# Altium project PCB_SECOND.PrjPcb
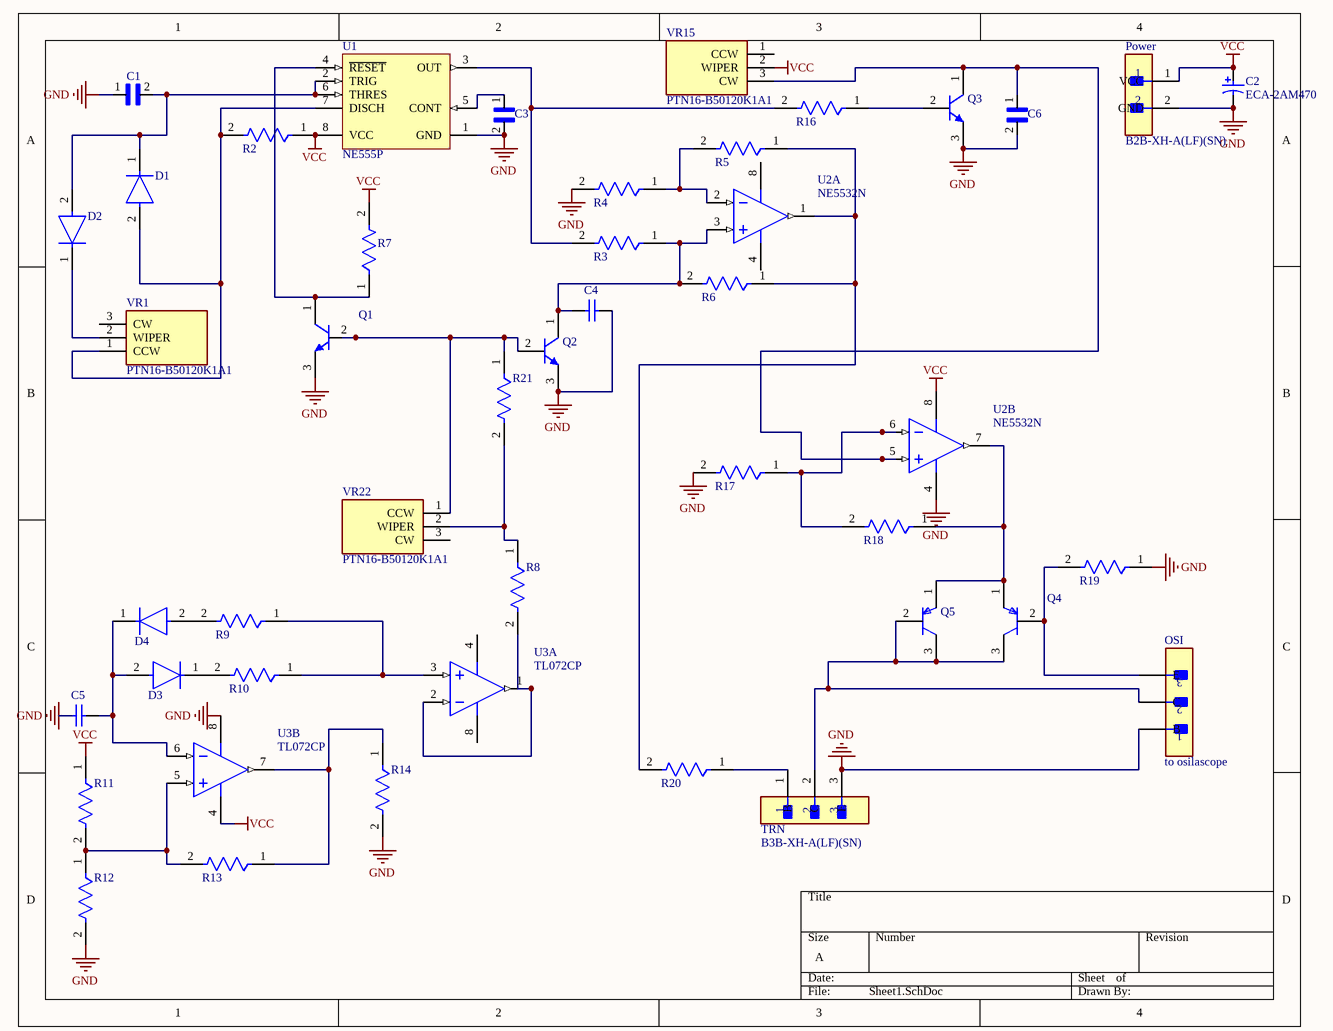
[diagram p0: Sheet1.SchDoc]
1 sheet, 43 parts. Net scope: global (net labels, ports and power ports of the same name join across sheets).
Board file: PCB1.PcbDoc

## Sheet Sheet1.SchDoc
size A; SheetNumber: 1; SheetTotal: 1

### Parts
C1  FG24X7R1A106KRT00  [CAPRB500W50L450T300H550]  (value not drawn)
C2  ECA-2AM470  [CAPPR65-350-1150X800X1250]
C3  FG24X7R1A106KRT00  [CAPRB500W50L450T300H550]  (value not drawn)
C4  SA115C104KAR  [AVX-SA115C104KAR]  (value not drawn)
C5  SA115C104KAR  [AVX-SA115C104KAR]  (value not drawn)
C6  FG24X7R1A106KRT00  [CAPRB500W50L450T300H550]  (value not drawn)
D1  1N4001-E3/54  [FP-1N4001-E3-54-MFG]  (value not drawn)
D2  1N4001-E3/54  [FP-1N4001-E3-54-MFG]  (value not drawn)
D3  1N4001-E3/54  [FP-1N4001-E3-54-MFG]  (value not drawn)
D4  1N4001-E3/54  [FP-1N4001-E3-54-MFG]  (value not drawn)
OSI  to osilascope  [FP-B3B-XH-A_LF_SN-MFG]
Power  B2B-XH-A(LF)(SN)  [FP-B2B-XH-A_LF_SN-MFG]
Q1  P2N2222ARL1G  [ONSC-TO-92-3-29-11_AM_BL]  (value not drawn)
Q2  P2N2222ARL1G  [ONSC-TO-92-3-29-11_AM_BL]  (value not drawn)
Q3  P2N2222ARL1G  [ONSC-TO-92-3-29-11_AM_BL]  (value not drawn)
Q4  2N3906TF  [FP-135AR-MFG]  (value not drawn)
Q5  2N3906TF  [FP-135AR-MFG]  (value not drawn)
R2  MRS16000C2002FCT00  [FP-MRS1600-MFG]  (value not drawn)
R3  MRS16000C2002FCT00  [FP-MRS1600-MFG]  (value not drawn)
R4  MRS16000C2002FCT00  [FP-MRS1600-MFG]  (value not drawn)
R5  MRS16000C2002FCT00  [FP-MRS1600-MFG]  (value not drawn)
R6  MRS16000C2002FCT00  [FP-MRS1600-MFG]  (value not drawn)
R7  MRS16000C2002FCT00  [FP-MRS1600-MFG]  (value not drawn)
R8  MRS16000C2002FCT00  [FP-MRS1600-MFG]  (value not drawn)
R9  MRS16000C2002FCT00  [FP-MRS1600-MFG]  (value not drawn)
R10  MRS16000C2002FCT00  [FP-MRS1600-MFG]  (value not drawn)
R11  MRS16000C2002FCT00  [FP-MRS1600-MFG]  (value not drawn)
R12  MRS16000C2002FCT00  [FP-MRS1600-MFG]  (value not drawn)
R13  MRS16000C2002FCT00  [FP-MRS1600-MFG]  (value not drawn)
R14  MRS16000C2002FCT00  [FP-MRS1600-MFG]  (value not drawn)
R16  MRS16000C2002FCT00  [FP-MRS1600-MFG]  (value not drawn)
R17  MRS16000C2002FCT00  [FP-MRS1600-MFG]  (value not drawn)
R18  MRS16000C2002FCT00  [FP-MRS1600-MFG]  (value not drawn)
R19  MRS16000C2002FCT00  [FP-MRS1600-MFG]  (value not drawn)
R20  MRS16000C2002FCT00  [FP-MRS1600-MFG]  (value not drawn)
R21  MRS16000C2002FCT00  [FP-MRS1600-MFG]  (value not drawn)
TRN  B3B-XH-A(LF)(SN)  [FP-B3B-XH-A_LF_SN-MFG]
U1  NE555P  [P0008A]
U2  NE5532N  [ONSC-PDIP-8-626-05]  (parts A,B of 2)
U3  TL072CP  [P0008A]  (parts A,B of 2)
VR1  PTN16-B50120K1A1  [PTN16B50120K1A1]
VR15  PTN16-B50120K1A1  [PTN16B50120K1A1]
VR22  PTN16-B50120K1A1  [PTN16B50120K1A1]

### Nets
GND: C1.1 C2.2 C3.2 C4.2 C5.1 C6.2 OSI.1(B) Power.2(GND) Q1.3(E) Q2.3(E) Q3.3(E) R4.2 R12.2 R14.2 R17.2 R19.1 TRN.3(E) U1.1(GND) U2.4(V-) U3.8(VCC+)
VCC: C2.1 Power.1(VCC) R2.1 R7.2 R11.1 U1.8(VCC) U2.8(V+) U3.4(VCC-) VR15.2(WIPER)
NetC1_2: C1.2 D1.1(C) D2.2(A) U1.2(TRIG) U1.6(THRES)
NetC3_1: C3.1 U1.5(CONT)
NetC4_1: C4.1 Q2.1(C) R3.1 R6.2 U2.3(INA+)
NetC5_2: C5.2 D3.2(A) D4.1(C) U3.6(IN2-)
NetC6_1: C6.1 Q3.1(C) U2.5(INB+) VR15.3(CW)
NetD1_2: D1.2(A) R2.2 U1.7(DISCH) VR1.1(CCW)
NetD2_1: D2.1(C) VR1.2(WIPER)
NetD3_1: D3.1(C) R10.2
NetD4_2: D4.2(A) R9.2
NetOSI_2: OSI.2(C) Q4.3(C) Q5.2(B) Q5.3(C) TRN.2(C)
NetOSI_3: OSI.3(E) Q4.2(B) R19.2
NetQ1_1: Q1.1(C) R7.1 U1.4(~{RESET})
NetQ1_2: Q1.2(B) Q2.2(B) R21.1 VR22.1(CCW)
NetQ3_2: Q3.2(B) R16.1
NetQ4_1: Q4.1(E) Q5.1(E) R18.1 U2.7(OUTB)
NetR3_2: R3.2 R16.2 U1.3(OUT)
NetR4_1: R4.1 R5.2 U2.2(INA-)
NetR5_1: R5.1 R6.1 R20.2 U2.1(OUTA)
NetR8_1: R8.1 R21.2 VR22.2(WIPER)
NetR8_2: R8.2 U3.1(OUT1) U3.2(IN1-)
NetR9_1: R9.1 R10.1 U3.3(IN1+)
NetR11_2: R11.2 R12.1 R13.2 U3.5(IN2+)
NetR13_1: R13.1 R14.1 U3.7(OUT2)
NetR17_1: R17.1 R18.2 U2.6(INB-)
NetR20_1: R20.1 TRN.1(B)

Not connected (* = marked no-connect by the designer): VR1 3(CW); VR15 1(CCW); VR22 3(CW)

### Library data of the parts
C1 C3 C6 = FG24X7R1A106KRT00: 10 ÂµF Â±10% 10V Ceramic Capacitor X7R Radial; MF: TDK; Purchase-URL: https://pricing.snapeda.com/search/part/FG24X7R1A106KRT00/?ref=eda; Value: *; SnapEDA_Link: https://www.snapeda.com/parts/FG24X7R1A106KRT00/TDK/view-part/?ref=snap; Package: Radial TDK; Availability: In Stock; Price: None; Check_prices: https://www.snapeda.com/parts/FG24X7R1A106KRT00/TDK/view-part/?ref=eda; MP: FG24X7R1A106KRT00
C2 = CMP-1665-00041-1: Aluminum Electrolytic Capacitor, 47 uF, +/- 20%, 100 V, -40 to 85 degC, 2-Pin THD, RoHS, Bulk; Data Rate: 54 mbps; Nominal Supply Voltage: 3.3 V; Case\Package: QFN; ComponentLink1URL: http://www.panasonic.com/; Packaging: Tape and Reel; PackageDescription: 2-Pin Radial Lead, Dia 8 mm, Body Length 11.5 mm; PackageReference: CAPPR65-350-1150X800X1250; ComponentLink2Description: Datasheet; Max Operating Temperature: 70 degC; ComponentLink2URL: http://industrial.panasonic.com/cdbs/www-data/pdf/RDF0000/ABA0000C1047.pdf; RoHSCompliant: true; Length: 7.7 mm; Min Operating Temperature: -20 degC; DatasheetVersion: Mar-16; Mount: Surface Mount; Pins: 48; Radiation Hardening: No; Package Quantity: 500; ComponentLink1Description: Manufacturer URL
C4 C5 = CMP-2000-07029-1: Axial Leads / SpinGuard(R), Ceramic Capacitor, 0.10 uF +/- 10%, 50V, -55 to 125 degC, 2-Pin THD, RoHS, Tape and Reel; Manufacturer: AVX; Other Names: 478-3151-1; Catalog Drawings: SASeries_4.32x3.05; Capacitance: 0.1µF; Temperature Coefficient: X7R; Online Catalog: SpinGuard®SASeries; Product Training Modules: ComponentSolutionsforSmartMeterApplications; Category: Capacitors; Package Description: 2-Pin Axial Lead, Dia 3.05 mm, Body Length 4.32 mm; Standard Package: 1; Mounting Technology: ThroughHole; Ratings: -; Datasheet Version: 06/2007; Voltage - Rated: 50V; Tolerance: ±10%; Package Reference: SA115C104KAR; Packaging: -; Lead Style: -; Size / Dimension: 0.120"Diax0.170"L(3.05mmx4.32mm); Mounting Type: ThroughHole; Operating Temperature: -55°C~125°C; Datasheet URL: https://datasheet.ciiva.com/27051/1074183-27051369.pdf; Applications: GeneralPurpose; Thickness (Max): -; Lead Spacing: -; Height - Seated (Max): -; Family: CeramicCapacitors; Package / Case: Axial; Features: -; Series: SpinGuard®SA; Manufacturer URL: http://www.avx.com/
D1-D4 = CMP-02540-000077-1: DIODE GEN PURP 50V 1A DO204AL; Max Surge Current: 30A; Forward Voltage: 1.1V; Capacitance: 15pF; Peak Non-Repetitive Surge Current: 45A; Polarity: Standard; Max Reverse Current: 5uA; Element Configuration: Single; Length: 0.204inch; Diameter: 2.7mm; Mount: Through Hole; Package Quantity: 5500; Series: -; Radiation Hardening: No; Width: 2.7mm; Max Forward Surge Current (Ifsm): 30A; Average Rectified Current: 1A; Voltage: 50V; Current Rating: 1A; Height: 2.7mm; Forward Current: 1A; Lead Free: Lead Free; Min Operating Temperature: -50°C; Number of Pins: 2; RoHS Compliant: Yes; Packaging: Tape and Reel; Current: 1A; Max Reverse Voltage (DC): 50V; Output Current: 1A; Reverse Voltage: 50V; Case/Package: DO-204AL; Max Repetitive Reverse Voltage (Vrrm): 50V; Voltage Rating (DC): 50V; Max Operating Temperature: 150°C
OSI TRN = CMP-17439-000014-3: CONN HEADER VERT 3POS 2.5MM; Max Voltage Rating (DC): 250V; Number of Positions: 3; Current Rating: 3A; Gender: Male; Wire/Cable Gauge: 22AWG; Contact Resistance: 20mR; Insulation Resistance: 1GR; Insulation Material: Nylon; Contact Plating: Tin; Depth: 5.75mm; Contact Type: Male Pin; Max Operating Temperature: 85°C; Insulation Color: Natural; Voltage Rating (AC): 250V; Color: Natural; Connector Type: Header; Orientation: Straight; Fastening Type: Detent; Housing Color: White; Min Operating Temperature: -25°C; Termination: Solder; Voltage Rating: 250V; Series: XH; Pitch: 2.5mm; Contact Shape: Square; Number of Rows: 1; Lead Free: Lead Free; Packaging: Bulk; Mount: Through Hole; Flammability Rating: UL94 V-0; Max Voltage Rating (AC): 250V; REACH SVHC: No SVHC; Housing Material: Polyamide; Contact Material: Brass; Lead Pitch: 2.5mm; Contact Finish - Mating: TIN; Length: 9.9mm; Max Current Rating: 3A; Number of Contacts: 3
Power = CMP-2000-05888-3: CONN HEADER VERT 2POS 2.5MM; Current Rating: 3A; Voltage Rating: 250V; Number of Contacts: 2; Contact Resistance: 20mR; Wire/Cable Gauge: 22AWG; Insulation Resistance: 1GR; Connector Type: Male Pin; Packaging: Bulk; Contact Material: Brass; Lead Free: Lead Free; Orientation: Straight; Contact Plating: Tin; Max Current Rating: 3A; Termination: Solder; Fastening Type: Detent; Depth: 5.75mm; Housing Material: Polyamide; REACH SVHC: No SVHC; Series: XH; Voltage Rating (AC): 250V; Number of Positions: 2; Color: Natural; Contact Type: Male Pin; Max Voltage Rating (DC): 250V; Pitch: 2.5mm; Lead Pitch: 2.5mm; Mount: Through Hole; Max Operating Temperature: 85°C; Length: 7.4mm; Max Voltage Rating (AC): 250V; Min Operating Temperature: -25°C; Number of Rows: 1; Housing Color: White
Q1-Q3 = CMP-1048-01587-1: Amplifier Transistor, NPN Silicon, 3-Pin TO-92, Pb-Free, Tape and Reel; Manufacturer: On Semiconductor; IC Continuous (A): 0.6; fT Min (MHz): 300; PackageDescription: 3-Pin Transistor Outline, Body 4.825 x 3.685 mm, Pitch 1.27 mm; PackageReference: TO-92-3-29-11_AM_BL; DatasheetVersion: Rev. 7; ComponentLink2Description: Datasheet; RoHS: TRUE; ComponentLink1Description: Manufacturer URL; ComponentLink1URL: http://www.onsemi.com/; PackageVersion: Rev. AM; Polarity: NPN; ComponentLink3Description: Package Specification; PartNumber: P2N2222ARL1G; ComponentLink3URL: http://www.onsemi.com/pub_link/Collateral/MAC97-D.PDF; Mounting Technology: Through Hole; ComponentLink2URL: http://www.onsemi.com/pub_link/Collateral/P2N2222A-D.PDF; Packing: Tape and Reel
Q4 Q5 = CMP-00278-84408866-1: 2N3906TF Small Signal Bipolar Transistor, 0.2A I(C), 40V V(BR)CEO, 1-Element, PNP, Silicon, TO-92; Manufacturer Lifecycle Status: ACTIVE; Collector Base Voltage (VCBO): -40V; Frequency: 250MHz; Number of Elements: 1; Max Power Dissipation: 625mW; Max Breakdown Voltage: 160V; Current Rating: -200mA; Emitter Base Voltage (VEBO): -5V; Collector Emitter Saturation Voltage: -400mV; Element Configuration: Single; Max Junction Temperature (Tj): 150°C; hFE Min: 100; Polarity: PNP; Lead Free: Lead Free; RoHS: Compliant; Max Operating Temperature: 150°C; Collector Emitter Voltage (VCEO): -40V; Max Frequency: 250MHz; Power Dissipation: 625mW; Height: 5.33mm; Schedule B: 8541210080; Mount: Through Hole; Length: 5.2mm; REACH SVHC: No SVHC; Min Operating Temperature: -55°C; Gain Bandwidth Product: 250MHz; Number of Pins: 3; Lifecycle Status: Production; Transition Frequency: 250MHz; NexarPartId: 84408866; Collector Emitter Breakdown Voltage: -40V; Case/Package: TO-92; Packaging: Tape and Reel; Width: 4.19mm; Max Collector Current: -200mA; Radiation Hardening: No; Weight: 240mg; Voltage Rating (DC): -40V
R2-R14 R16-R21 = CMP-02408-000019-1: RES 20K OHM 0.4W 1% AXIAL; Max Power Dissipation: 400mW; Temperature Coefficient: 50ppm/°C; Resistance: 20kR; Technology: THIN FILM; Max Operating Temperature: 155°C; Number of Terminations: 2; RoHS Compliant: Yes; Packaging: Tape and Reel; Radiation Hardening: No; Contact Plating: Tin; Military Standard: Not; Construction: Cylindrical; Diameter: 1.6mm; Tolerance: 1%; Mount: Through Hole; Power Rating: 400mW; Case/Package: Conformal; Termination: Axial; Length: 3.6mm; Min Operating Temperature: -55°C; Resistor Type: Metal Film; Series: MRS16
U1 = CMP-2000-04954-1: Precision Timer, 4.5 to 16 V, 0 to 70 degC, 8-Pin DIP, Pb-Free, Tube; Manufacturer: TexasInstruments; Maximum High Level Output Current: -200mA; Number of Internal Timers: 1; Operating Supply Voltage: 5; Maximum Low Level Output Current: 200mA; Rad Hard: No; Packaging: Rail/Tube; Manufacturer URL: http://www.ti.com/; Package Reference: P8; Package Description: 8-Pin Double In-line Package, Body 9.59 x 6.35 mm, Pitch 2.54 mm; Package URL: http://www.ti.com/lit/ml/mpdi001b/mpdi001b.pdf; Type: Standard; Datasheet URL: http://www.ti.com/general/docs/lit/getliterature.tsp?genericPartNumber=NE555&fileType=pdf; Category: Timer; Package: 8PDIP; Datasheet Version: Rev. I, 09/2014
U2 = CMP-1310-00070-1: Internally Compensated Dual Low Noise Operational Amplifier, 6 to 40 V, 0 to 70 degC, 8-Pin PDIP, Tube; Manufacturer: On Semiconductor; VCC Min (V): 6; VCC Max (V): 40; GBW Typ (MHz): 10; SR Typ (V/uS): 9; Mounting Technology: Through Hole; PackageVersion: Rev. N, 06/2013; PartNumber: NE5532N; PackageDescription: 8-Pin Plastic Dual-In Line Package, Body 9.59 x 6.605 mm, Pitch 2.54 mm; ComponentLink3URL: http://www.onsemi.cn/pub_link/Collateral/626-05.PDF; PackageReference: PDIP-8-626-05; ComponentLink2Description: Datasheet; ComponentLink3Description: Package Specification; RoHS: FALSE; ComponentLink1URL: http://www.onsemi.com/; ComponentLink1Description: Manufacturer URL; ComponentLink2URL: http://www.onsemi.cn/pub_link/Collateral/NE5532-D.PDF; Packing: Tube; DatasheetVersion: Rev. 2
U3 = CMP-0017-00950-2: Dual Low-Noise JFET-Input General-Purpose Operational Amplifier, 7 to 36 V, 0 to 70 degC, 8-pin DIP (P8), Pb-Free (RoHS); Manufacturer: Texas Instruments; Sub Family: General Purpose Amplifier, High Supply Voltage Amplifier (>=30V); Total Supply Voltage(Max)(+5V is 5, +/-5V is 10): 36; Slew Rate(Typ)(V/us): 13; Vn at 1kHz(Typ)(nV/rtHz): 18; GBW(Typ)(MHz): 3; CMRR(Min)(dB): 70; Total Supply Voltage(Min)(+5V is 5, +/-5V is 10): 7; Vio (25C)(Max)(mV): 10; Rating: Catalog; IIB(Max)(pA): 200; Iq per channel(Max)(mA): 2.5; Number of Channels: 2; Mounting Technology: Through Hole; ComponentLink3Description: Package Specification; PartNumber: TL072CP; PackageVersion: 4040082/E, 04/2010; Eco-Plan: Pb-Free (RoHS); DatasheetVersion: SLOS080J; Offset Drift(Typ)(uV/C): 18; ComponentLink3URL: http://www.ti.com/litv/pdf/mpdi001b; PackageDescription: 8-Pin Plastic In-Line, Body 9.59 x 6.35 mm, Pitch 2.54 mm; Code_JEDEC: MS-001; ComponentLink2URL: http://www.ti.com/lit/ds/symlink/tl072.pdf; ComponentLink1Description: Manufacturer URL; ComponentLink2Description: Datasheet; ComponentLink1URL: http://www.ti.com/; PackageReference: P0008A
VR1 VR15 VR22 = PTN16-B50120K1A1: Variable Resistor; Manufacturer_Name: CUI Devices; Datasheet Link: https://www.cuidevices.com/product/resource/ptn16.pdf; Height: 26.75mm; Manufacturer_Part_Number: PTN16-B50120K1A1